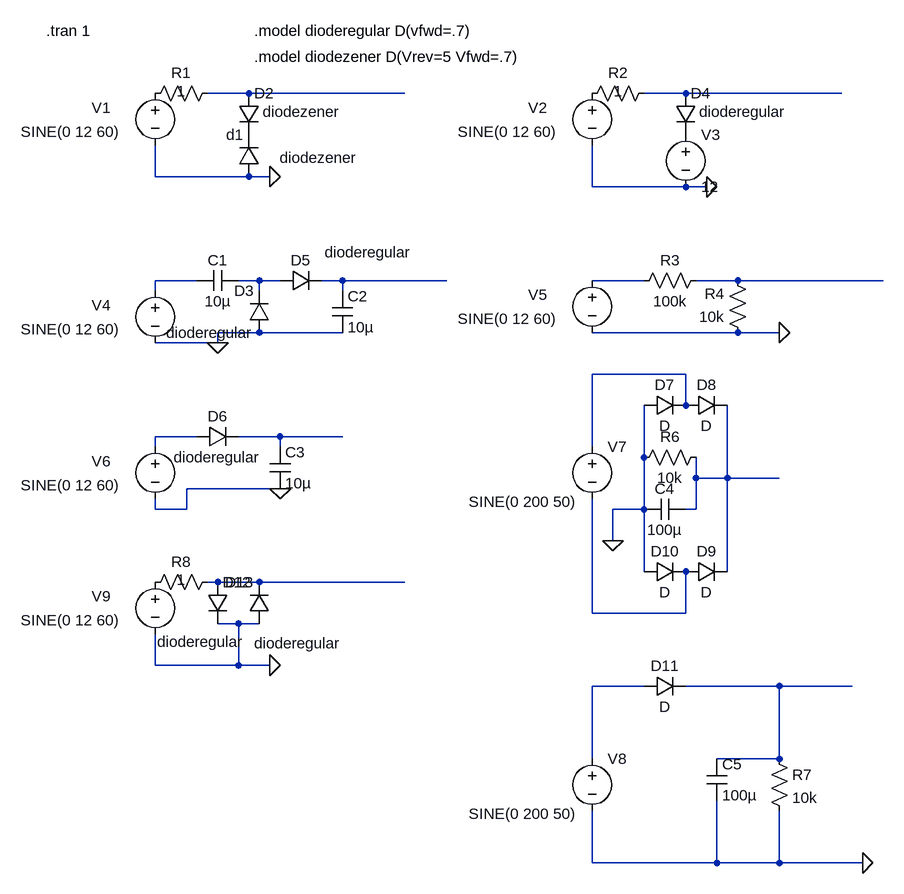
[diagram p0: schematic ee330mid2.asc]
ee330mid2.asc, the LTspice schematic file:
Version 4
SHEET 1 1220 1268
WIRE 240 64 176 64
WIRE 480 64 240 64
WIRE 912 64 848 64
WIRE 1152 64 912 64
WIRE 96 192 96 144
WIRE 240 192 96 192
WIRE 272 192 240 192
WIRE 768 208 768 144
WIRE 912 208 768 208
WIRE 944 208 912 208
WIRE 160 352 96 352
WIRE 256 352 224 352
WIRE 288 352 256 352
WIRE 384 352 352 352
WIRE 544 352 384 352
WIRE 848 352 768 352
WIRE 992 352 928 352
WIRE 1216 352 992 352
WIRE 96 368 96 352
WIRE 256 368 256 352
WIRE 384 368 384 352
WIRE 256 432 192 432
WIRE 384 432 256 432
WIRE 992 432 768 432
WIRE 1056 432 992 432
WIRE 192 448 192 432
WIRE 192 448 96 448
WIRE 912 496 768 496
WIRE 912 544 912 496
WIRE 160 592 96 592
WIRE 288 592 224 592
WIRE 384 592 288 592
WIRE 96 608 96 592
WIRE 288 608 288 592
WIRE 768 608 768 496
WIRE 848 624 848 544
WIRE 928 656 928 624
WIRE 976 656 976 544
WIRE 976 656 928 656
WIRE 1056 656 976 656
WIRE 288 672 144 672
WIRE 96 704 96 688
WIRE 144 704 144 672
WIRE 144 704 96 704
WIRE 848 704 848 624
WIRE 848 704 800 704
WIRE 928 704 928 656
WIRE 928 704 912 704
WIRE 800 752 800 704
WIRE 848 800 848 704
WIRE 976 800 976 656
WIRE 192 816 176 816
WIRE 256 816 192 816
WIRE 480 816 256 816
WIRE 768 864 768 688
WIRE 912 864 912 800
WIRE 912 864 768 864
WIRE 224 880 192 880
WIRE 256 880 224 880
WIRE 96 944 96 896
WIRE 224 944 224 880
WIRE 224 944 96 944
WIRE 272 944 224 944
WIRE 848 976 768 976
WIRE 1056 976 912 976
WIRE 1168 976 1056 976
WIRE 768 1088 768 976
WIRE 1056 1088 1056 976
WIRE 1056 1088 960 1088
WIRE 768 1248 768 1168
WIRE 960 1248 960 1152
WIRE 960 1248 768 1248
WIRE 1056 1248 1056 1168
WIRE 1056 1248 960 1248
WIRE 1184 1248 1056 1248
FLAG 272 192 0
FLAG 944 208 0
FLAG 192 448 0
FLAG 1056 432 0
FLAG 288 672 0
FLAG 800 752 0
FLAG 1184 1248 0
FLAG 272 944 0
SYMBOL res 192 48 R90
WINDOW 0 0 56 VBottom 2
WINDOW 3 28 56 VBottom 2
SYMATTR InstName R1
SYMATTR Value 1
SYMBOL diode 256 192 R180
WINDOW 0 24 64 Left 2
WINDOW 3 -151 29 Left 2
SYMATTR InstName d1
SYMATTR Value diodezener
SYMBOL diode 224 64 R0
WINDOW 3 37 28 Left 2
SYMATTR Value diodezener
SYMATTR InstName D2
SYMBOL voltage 96 48 R0
WINDOW 0 -98 38 Left 2
WINDOW 3 -207 75 Left 2
WINDOW 123 0 0 Left 0
WINDOW 39 0 0 Left 0
SYMATTR InstName V1
SYMATTR Value SINE(0 12 60)
SYMBOL res 864 48 R90
WINDOW 0 0 56 VBottom 2
WINDOW 3 28 56 VBottom 2
SYMATTR InstName R2
SYMATTR Value 1
SYMBOL diode 896 64 R0
WINDOW 3 37 28 Left 2
SYMATTR Value dioderegular
SYMATTR InstName D4
SYMBOL voltage 912 112 R0
WINDOW 123 0 0 Left 0
WINDOW 39 0 0 Left 0
SYMATTR InstName V3
SYMATTR Value 12
SYMBOL cap 224 336 R90
WINDOW 0 0 32 VBottom 2
WINDOW 3 32 32 VTop 2
SYMATTR InstName C1
SYMATTR Value 10µ
SYMBOL diode 272 432 R180
WINDOW 3 24 0 Left 2
WINDOW 0 24 64 Left 2
SYMATTR Value dioderegular
SYMATTR InstName D3
SYMBOL diode 288 368 R270
WINDOW 0 32 32 VTop 2
WINDOW 3 75 136 VBottom 2
SYMATTR InstName D5
SYMATTR Value dioderegular
SYMBOL cap 368 368 R0
SYMATTR InstName C2
SYMATTR Value 10µ
SYMBOL res 944 336 R90
WINDOW 0 0 56 VBottom 2
WINDOW 3 32 56 VTop 2
SYMATTR InstName R3
SYMATTR Value 100k
SYMBOL res 1008 448 R180
WINDOW 0 36 76 Left 2
WINDOW 3 36 40 Left 2
SYMATTR InstName R4
SYMATTR Value 10k
SYMBOL diode 160 608 R270
WINDOW 0 32 32 VTop 2
WINDOW 3 0 32 VBottom 2
SYMATTR InstName D6
SYMATTR Value dioderegular
SYMBOL cap 272 608 R0
SYMATTR InstName C3
SYMATTR Value 10µ
SYMBOL voltage 768 592 R0
WINDOW 3 -190 100 Left 2
WINDOW 123 0 0 Left 0
WINDOW 39 0 0 Left 0
SYMATTR InstName V7
SYMATTR Value SINE(0 200 50)
SYMBOL diode 848 560 R270
WINDOW 0 32 32 VTop 2
WINDOW 3 0 32 VBottom 2
SYMATTR InstName D7
SYMBOL diode 912 560 R270
WINDOW 0 32 32 VTop 2
WINDOW 3 0 32 VBottom 2
SYMATTR InstName D8
SYMBOL diode 912 816 R270
WINDOW 0 32 32 VTop 2
WINDOW 3 0 32 VBottom 2
SYMATTR InstName D9
SYMBOL diode 848 816 R270
WINDOW 0 32 32 VTop 2
WINDOW 3 0 32 VBottom 2
SYMATTR InstName D10
SYMBOL res 944 608 R90
WINDOW 0 0 56 VBottom 2
WINDOW 3 32 56 VTop 2
SYMATTR InstName R6
SYMATTR Value 10k
SYMBOL cap 912 688 R90
WINDOW 0 0 32 VBottom 2
WINDOW 3 32 32 VTop 2
SYMATTR InstName C4
SYMATTR Value 100µ
SYMBOL voltage 768 1072 R0
WINDOW 3 -190 100 Left 2
WINDOW 123 0 0 Left 0
WINDOW 39 0 0 Left 0
SYMATTR InstName V8
SYMATTR Value SINE(0 200 50)
SYMBOL diode 848 992 R270
WINDOW 0 32 32 VTop 2
WINDOW 3 0 32 VBottom 2
SYMATTR InstName D11
SYMBOL cap 944 1088 R0
SYMATTR InstName C5
SYMATTR Value 100µ
SYMBOL res 1040 1072 R0
SYMATTR InstName R7
SYMATTR Value 10k
SYMBOL voltage 768 48 R0
WINDOW 0 -98 38 Left 2
WINDOW 3 -207 75 Left 2
WINDOW 123 0 0 Left 0
WINDOW 39 0 0 Left 0
SYMATTR InstName V2
SYMATTR Value SINE(0 12 60)
SYMBOL voltage 96 352 R0
WINDOW 0 -98 38 Left 2
WINDOW 3 -207 75 Left 2
WINDOW 123 0 0 Left 0
WINDOW 39 0 0 Left 0
SYMATTR InstName V4
SYMATTR Value SINE(0 12 60)
SYMBOL voltage 768 336 R0
WINDOW 0 -98 38 Left 2
WINDOW 3 -207 75 Left 2
WINDOW 123 0 0 Left 0
WINDOW 39 0 0 Left 0
SYMATTR InstName V5
SYMATTR Value SINE(0 12 60)
SYMBOL voltage 96 592 R0
WINDOW 0 -98 38 Left 2
WINDOW 3 -207 75 Left 2
WINDOW 123 0 0 Left 0
WINDOW 39 0 0 Left 0
SYMATTR InstName V6
SYMATTR Value SINE(0 12 60)
SYMBOL res 192 800 R90
WINDOW 0 0 56 VBottom 2
WINDOW 3 28 56 VBottom 2
SYMATTR InstName R8
SYMATTR Value 1
SYMBOL voltage 96 800 R0
WINDOW 0 -98 38 Left 2
WINDOW 3 -207 75 Left 2
WINDOW 123 0 0 Left 0
WINDOW 39 0 0 Left 0
SYMATTR InstName V9
SYMATTR Value SINE(0 12 60)
SYMBOL diode 176 816 R0
WINDOW 3 72 94 Left 2
SYMATTR InstName D12
SYMATTR Value dioderegular
SYMBOL diode 272 880 R180
WINDOW 0 24 64 Left 2
WINDOW 3 38 -28 Left 2
SYMATTR InstName D13
SYMATTR Value dioderegular
TEXT 248 8 Left 2 !.model diodezener D(Vrev=5 Vfwd=.7)
TEXT -72 -32 Left 2 !.tran 1
TEXT 248 -32 Left 2 !.model dioderegular D(vfwd=.7)

The netlist it stands for:
* ee330mid2.asc
R1 N001 P001 1
d1 0 P002 diodezener
D2 N001 P002 diodezener
V1 P001 0 SINE(0 12 60)
R2 N002 P003 1
D4 N002 P004 dioderegular
V3 P004 0 12
C1 N004 N003 10µ
D3 0 N004 dioderegular
D5 N004 N005 dioderegular
C2 N005 0 10µ
R3 N007 N006 100k
R4 0 N007 10k
D6 N009 N010 dioderegular
C3 N010 0 10µ
V7 N008 N013 SINE(0 200 50)
D7 0 N008 D
D8 N008 N011 D
D9 N013 N011 D
D10 0 N013 D
R6 N011 0 10k
C4 N011 0 100µ
V8 N014 0 SINE(0 200 50)
D11 N014 N015 D
C5 N015 0 100µ
R7 N015 0 10k
V2 P003 0 SINE(0 12 60)
V4 N003 0 SINE(0 12 60)
V5 N006 0 SINE(0 12 60)
V6 N009 0 SINE(0 12 60)
R8 N012 P005 1
V9 P005 0 SINE(0 12 60)
D12 N012 0 dioderegular
D13 0 N012 dioderegular
.model D D
.lib standard.dio
.model diodezener D(Vrev=5 Vfwd=.7)
.tran 1
.model dioderegular D(vfwd=.7)
.backanno
.end